# EAGLE schematic main (EAGLE 9.6.2)
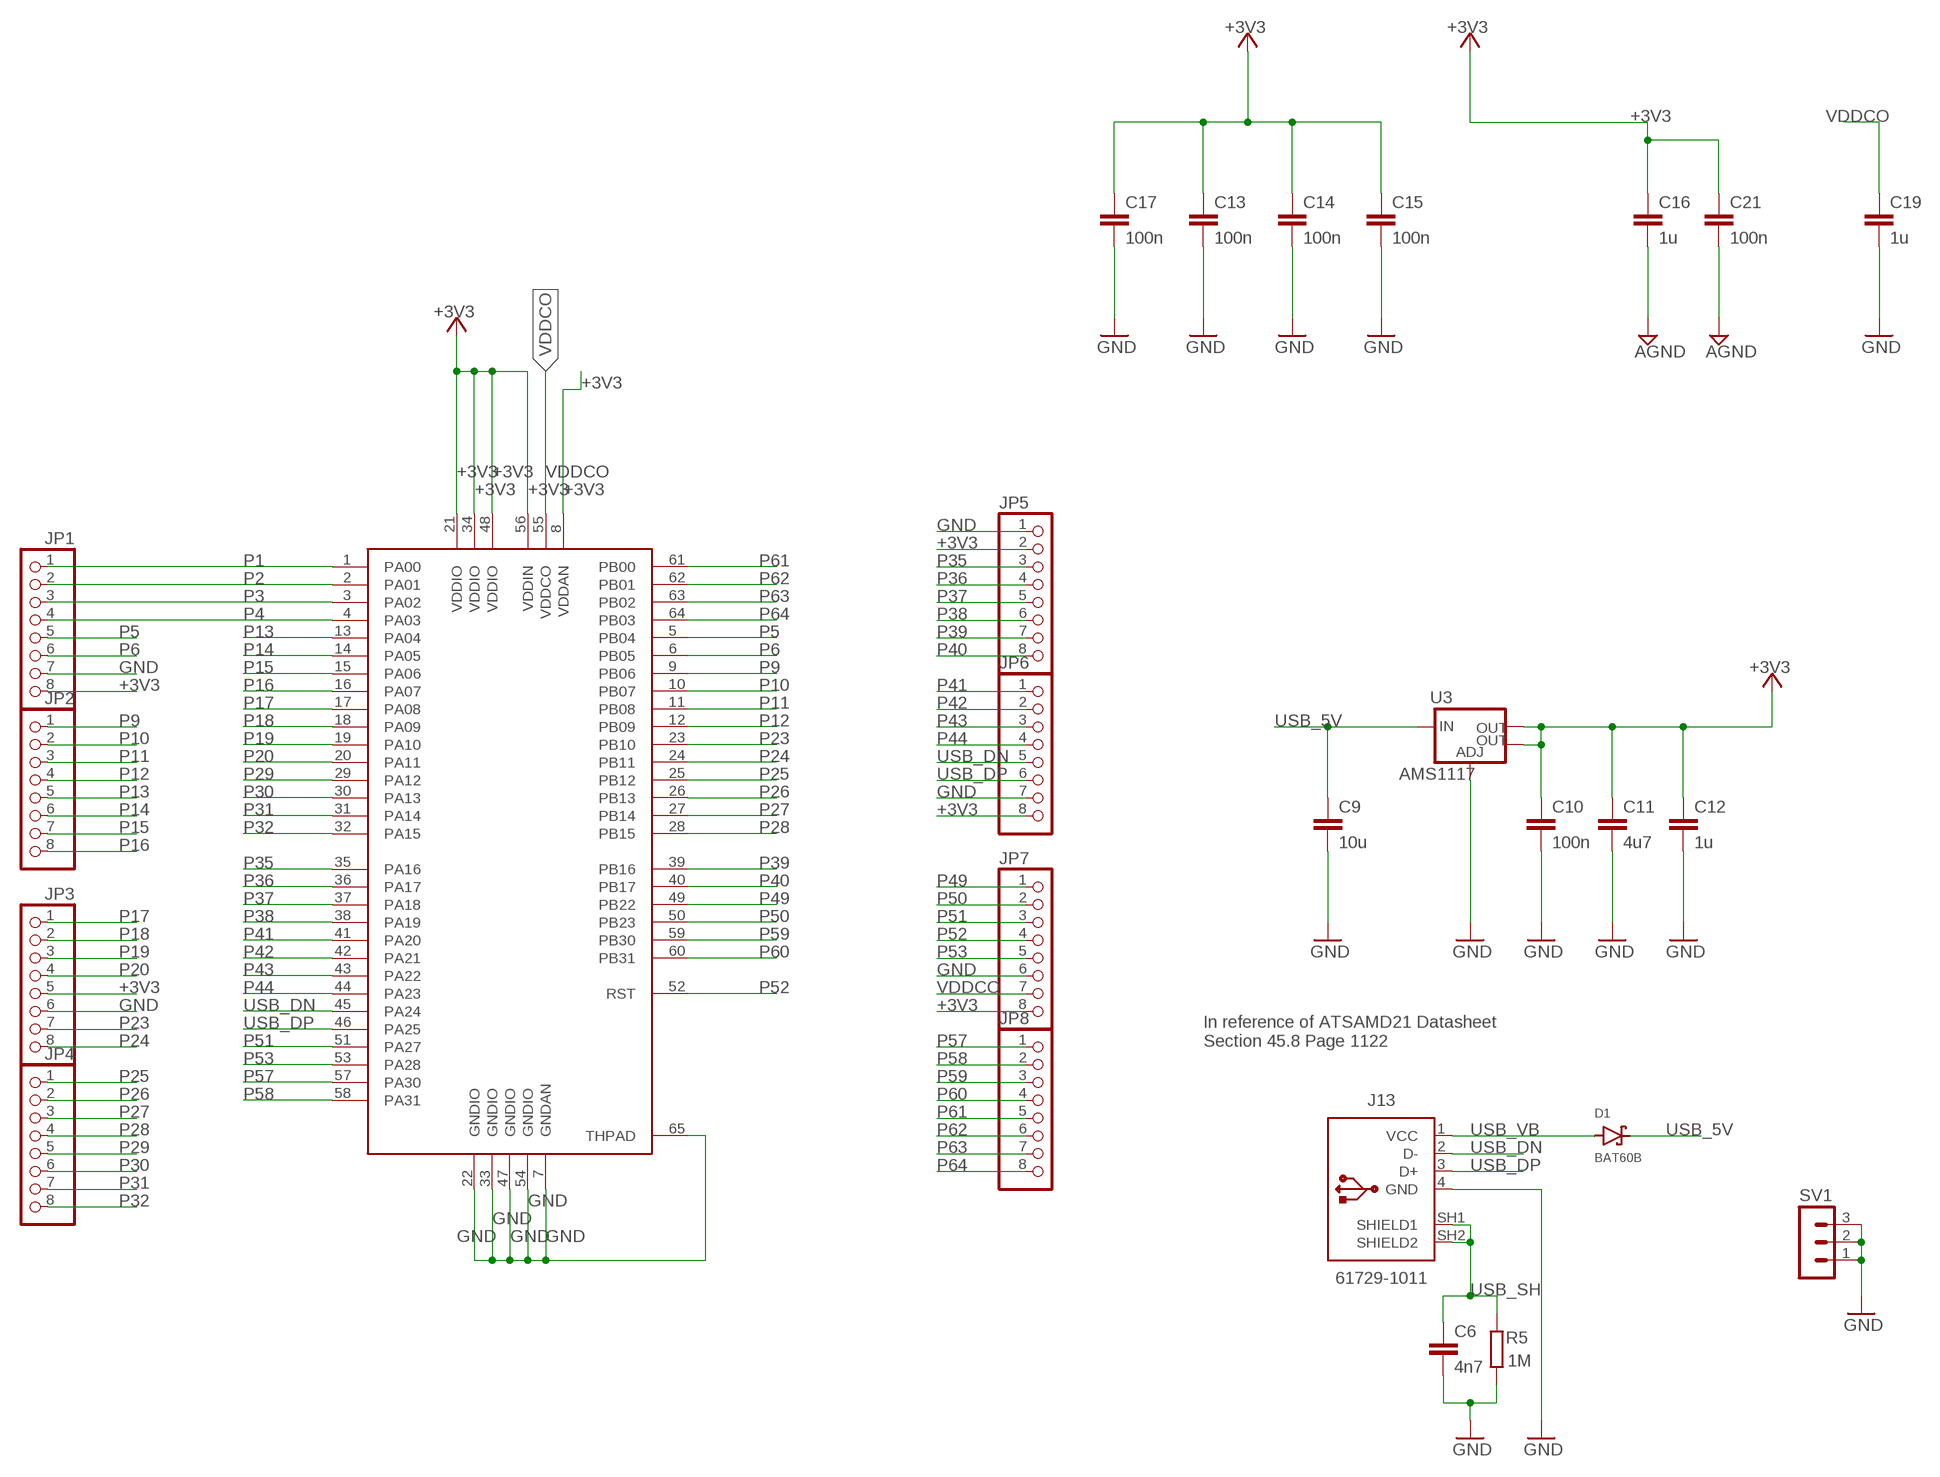
[diagram p0: schematic, sheet 1]

## Parts
C6  4n7  C-EUC0603  [C0603]
C9  10u  C-EUC0603  [C0603]
C10  100n  C-EUC0603  [C0603]
C11  4u7  C-EUC0603  [C0603]
C12  1u  C-EUC0603  [C0603]
C13  100n  C-EUC0603  [C0603]
C14  100n  C-EUC0603  [C0603]
C15  100n  C-EUC0603  [C0603]
C16  1u  C-EUC0603  [C0603]
C17  100n  C-EUC0603  [C0603]
C19  1u  C-EUC0603  [C0603]
C21  100n  C-EUC0603  [C0603]
D1  BAT60B  1N5817-B  [DO41-7.6]
J13  61729-1011  [61729-1011BLF]
JP1  PINHD-1X8CLEANBIG  [1X08-CLEANBIG]
JP2  PINHD-1X8CLEANBIG  [1X08-CLEANBIG]
JP3  PINHD-1X8CLEANBIG  [1X08-CLEANBIG]
JP4  PINHD-1X8CLEANBIG  [1X08-CLEANBIG]
JP5  PINHD-1X8CLEANBIG  [1X08-CLEANBIG]
JP6  PINHD-1X8CLEANBIG  [1X08-CLEANBIG]
JP7  PINHD-1X8CLEANBIG  [1X08-CLEANBIG]
JP8  PINHD-1X8CLEANBIG  [1X08-CLEANBIG]
R5  1M  R-EU_R0603  [R0603]
SV1  MA03-1  [MA03-1]
U3  AMS1117  V_REG_LM1117SOT223  [SOT223]
U$1  ATSAMD21J18AQFN64  [QFN50P900X900X100-65T535]

## Nets
+3V3: C10.1 C11.1 C12.1 C13.1 C14.1 C15.1 C16.1 C17.1 C21.1 JP1.8 JP3.5 JP5.2 JP6.8 JP7.8 U3.2(OUT) U3.4(OUT) U$1.8(VDDAN) U$1.21(VDDIO) U$1.34(VDDIO) U$1.48(VDDIO) U$1.56(VDDIN)
GND: C6.2 C9.2 C10.2 C11.2 C12.2 C13.2 C14.2 C15.2 C16.2 C17.2 C19.2 C21.2 J13.4(GND) JP1.7 JP3.6 JP5.1 JP6.7 JP7.6 R5.2 SV1.1 SV1.2 SV1.3 U3.1(ADJ) U$1.7(GNDAN) U$1.22(GNDIO) U$1.33(GNDIO) U$1.47(GNDIO) U$1.54(GNDIO) U$1.65(THPAD) ; supply symbol labelled AGND
P1: JP1.1 U$1.1(PA00)
P2: JP1.2 U$1.2(PA01)
P3: JP1.3 U$1.3(PA02)
P4: JP1.4 U$1.4(PA03)
P5: JP1.5 U$1.5(PB04)
P6: JP1.6 U$1.6(PB05)
P9: JP2.1 U$1.9(PB06)
P10: JP2.2 U$1.10(PB07)
P11: JP2.3 U$1.11(PB08)
P12: JP2.4 U$1.12(PB09)
P13: JP2.5 U$1.13(PA04)
P14: JP2.6 U$1.14(PA05)
P15: JP2.7 U$1.15(PA06)
P16: JP2.8 U$1.16(PA07)
P17: JP3.1 U$1.17(PA08)
P18: JP3.2 U$1.18(PA09)
P19: JP3.3 U$1.19(PA10)
P20: JP3.4 U$1.20(PA11)
P23: JP3.7 U$1.23(PB10)
P24: JP3.8 U$1.24(PB11)
P25: JP4.1 U$1.25(PB12)
P26: JP4.2 U$1.26(PB13)
P27: JP4.3 U$1.27(PB14)
P28: JP4.4 U$1.28(PB15)
P29: JP4.5 U$1.29(PA12)
P30: JP4.6 U$1.30(PA13)
P31: JP4.7 U$1.31(PA14)
P32: JP4.8 U$1.32(PA15)
P35: JP5.3 U$1.35(PA16)
P36: JP5.4 U$1.36(PA17)
P37: JP5.5 U$1.37(PA18)
P38: JP5.6 U$1.38(PA19)
P39: JP5.7 U$1.39(PB16)
P40: JP5.8 U$1.40(PB17)
P41: JP6.1 U$1.41(PA20)
P42: JP6.2 U$1.42(PA21)
P43: JP6.3 U$1.43(PA22)
P44: JP6.4 U$1.44(PA23)
P49: JP7.1 U$1.49(PB22)
P50: JP7.2 U$1.50(PB23)
P51: JP7.3 U$1.51(PA27)
P52: JP7.4 U$1.52(RST)
P53: JP7.5 U$1.53(PA28)
P57: JP8.1 U$1.57(PA30)
P58: JP8.2 U$1.58(PA31)
P59: JP8.3 U$1.59(PB30)
P60: JP8.4 U$1.60(PB31)
P61: JP8.5 U$1.61(PB00)
P62: JP8.6 U$1.62(PB01)
P63: JP8.7 U$1.63(PB02)
P64: JP8.8 U$1.64(PB03)
USB_5V: C9.1 D1.C U3.3(IN)
USB_DN: J13.2(D-) JP6.5 U$1.45(PA24)
USB_DP: J13.3(D+) JP6.6 U$1.46(PA25)
USB_SH: C6.1 J13.SH1(SHIELD1) J13.SH2(SHIELD2) R5.1
USB_VB: D1.A J13.1(VCC)
VDDCO: C19.1 JP7.7 U$1.55(VDDCO)

## Notes on the sheet
- In reference of ATSAMD21 Datasheet
  Section 45.8 Page 1122

## Library data of the parts
C6 C9-C17 C19 C21 = rcl:C-EU: CAPACITOR, European symbol; SPICEPREFIX: C
D1 = diode:1N581*: 1.0A SCHOTTKY BARRIER RECTIFIER Source: http://www.diodes.com/datasheets/ds23001.pdf
J13 = Connector_USB:61729-1011: USB(2.0) Type-B, RCPT, 4POS, THT-R/A Datasheet <https://www.amphenol-icc.com/media/wysiwyg/files/drawing/61729.pdf>; CATEGORY: Connector; CONTACTS: 4; CURRENT_RATING: 1A; DESCRIPTION: CONN RCPT USB2.0 TYPEB 4POS R/A; GENDER: Receptacle; MANUFACTURER: Amphenol ICC (FCI); MOUNT_TYPE: R/A; MPN: 61729-1011BLF; OPERATING_TEMP: -55°C to 85°C; PART_STATUS: Active; ROHS_COMPLIANT: RoHS Compliant; SERIES: 61729; SUB-CATEGORY: USB; TYPE: USB-B
JP1-JP8 = larger_pad_header:PINHD-1X8: PIN HEADER
R5 = rcl:R-EU_: RESISTOR, European symbol; SPICEPREFIX: R
SV1 = con-lstb:MA03-1: PIN HEADER; OC_FARNELL: unknown; OC_NEWARK: unknown
U3 = SparkFun-IC-Power:V_REG_LM1117: Voltage Regulator LM1117 Standard adjustable voltage regulator but in SMD form. Spark Fun Electronics SKU : COM-00595; PROD_ID: VREG-08170
U$1 = atsamd21j18a:ATSAMD21J18A